# EAGLE design scarf_no_mic (EAGLE 6.5.0)
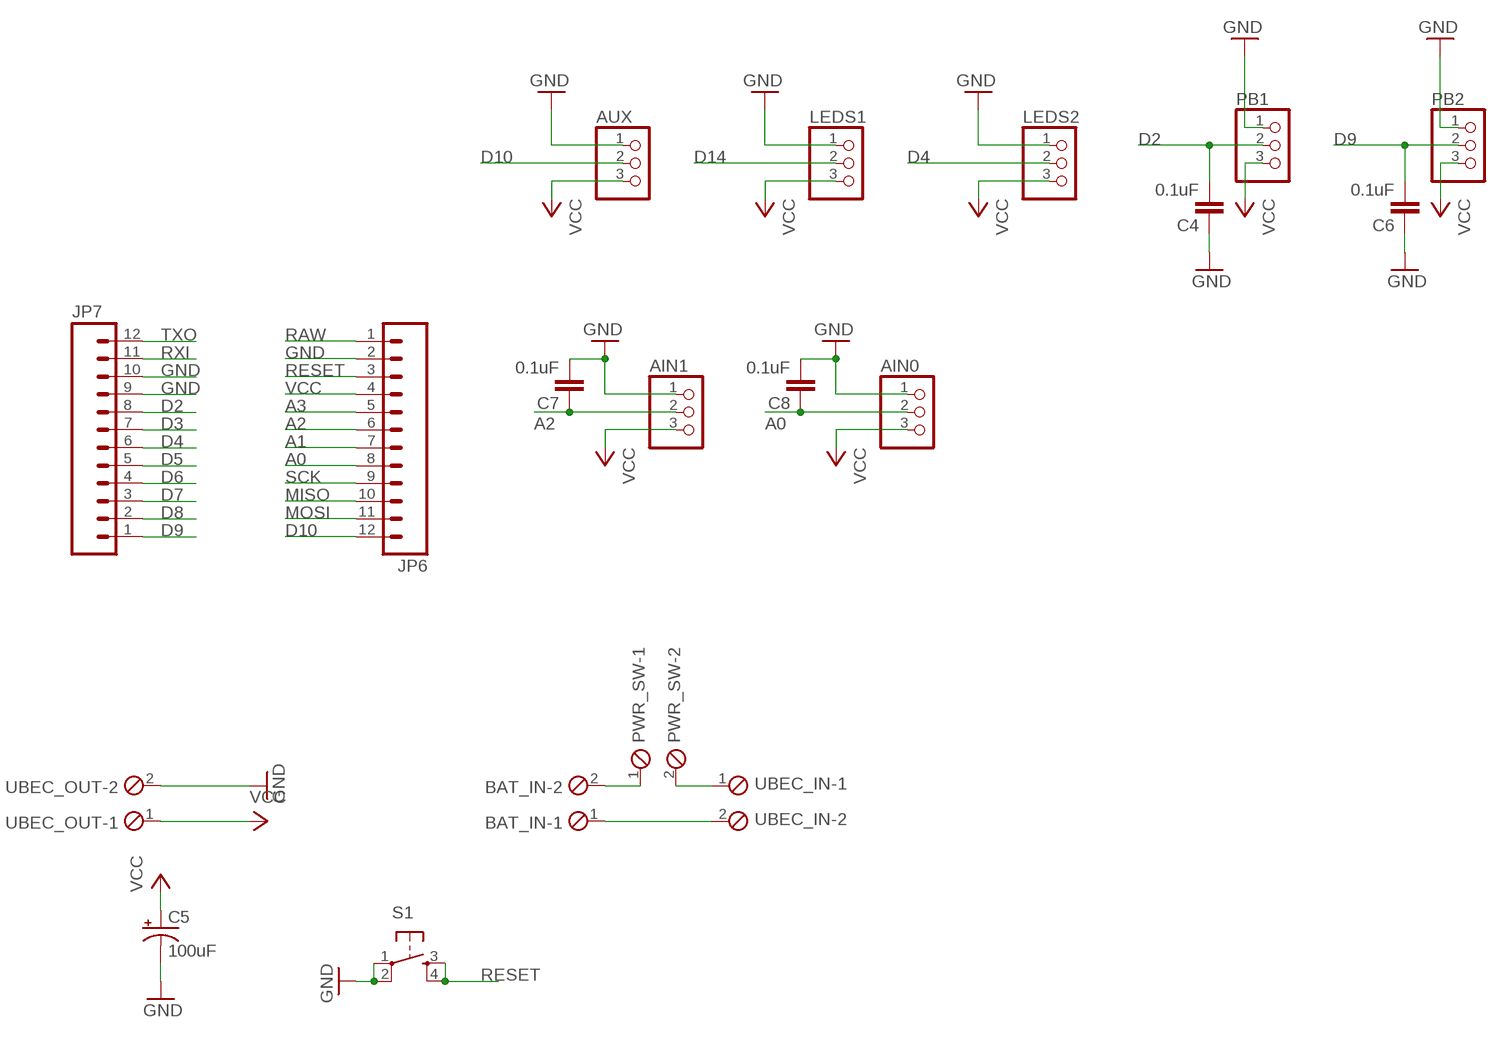
[diagram p0: schematic, sheet 1]

## Parts
AIN0  HEADER-1X3ROUND  [1X03_ROUND]
AIN1  HEADER-1X3ROUND  [1X03_ROUND]
AUX  HEADER-1X3ROUND  [1X03_ROUND]
BAT_IN  MPT2  [2POL254]
C4  0.1uF  C-EU025-025X050  [C025-025X050]
C5  100uF  CPOL-USE3.5-8  [E3,5-8]
C6  0.1uF  C-EU025-025X050  [C025-025X050]
C7  0.1uF  C-EU025-025X050  [C025-025X050]
C8  0.1uF  C-EU025-025X050  [C025-025X050]
JP6  M12PTH  [1X12]
JP7  M12PTH  [1X12]
LEDS1  PINHD-1X3  [1X03]
LEDS2  PINHD-1X3  [1X03]
PB1  HEADER-1X3ROUND  [1X03_ROUND]
PB2  HEADER-1X3ROUND  [1X03_ROUND]
PWR_SW  MPT2  [2POL254]
S1  TAC_SWITCHPTH  [TACTILE-PTH]
UBEC_IN  MPT2  [2POL254]
UBEC_OUT  MPT2  [2POL254]

## Nets
A0: AIN0.2 C8.1 JP6.8
A1: JP6.7
A2: AIN1.2 C7.1 JP6.6
A3: JP6.5
D2: C4.2 JP7.8 PB1.2
D3: JP7.7
D4: JP7.6 LEDS2.2
D5: JP7.5
D6: JP7.4
D7: JP7.3
D8: JP7.2
D9: C6.2 JP7.1 PB2.2
D10: AUX.2 JP6.12
D14: LEDS1.2
GND [vcc]: AIN0.1 AIN1.1 AUX.1 C4.1 C5.- C6.1 C7.2 C8.2 JP6.2 JP7.9 JP7.10 LEDS1.1 LEDS2.1 PB1.1 PB2.1 S1.1 S1.2 UBEC_OUT.2
MISO: JP6.10
MOSI: JP6.11
N$1: BAT_IN.2 PWR_SW.1
N$2: PWR_SW.2 UBEC_IN.1
N$3: BAT_IN.1 UBEC_IN.2
RAW [vcc]: JP6.1
RESET: JP6.3 S1.3 S1.4
RXI: JP7.11
SCK: JP6.9
TXO: JP7.12
VCC: AIN0.3 AIN1.3 AUX.3 C5.+ JP6.4 LEDS1.3 LEDS2.3 PB1.3 PB2.3 UBEC_OUT.1

## Library data of the parts
AIN0 AIN1 AUX PB1 PB2 = microbuilder:HEADER-1X3: PIN HEADER
BAT_IN PWR_SW UBEC_IN UBEC_OUT = con-phoenix-254:MPT2: PHOENIX CONNECTOR; OC_FARNELL: unknown; OC_NEWARK: unknown
C4 C6-C8 = rcl:C-EU: CAPACITOR, European symbol
C5 = rcl:CPOL-US: POLARIZED CAPACITOR, American symbol
JP6 JP7 = SparkFun:M12: Header 12 Standard 12-pin 0.1" header. Use with straight break away headers (SKU : PRT-00116), right angle break away headers (PRT-00553), swiss pins (PRT-00743), machine pins (PRT-00117), and female headers (PRT-00115).
LEDS1 LEDS2 = pinhead:PINHD-1X3: PIN HEADER
S1 = SparkFun-Electromechanical:TAC_SWITCH: Momentary Switch Button commonly used for reset or general input. Spark Fun Electronics SKU : COM-00097 SMT- SWCH-08247

## Net classes
0 default: width 0.254 mm
1 vcc: width 0.406 mm

## Board
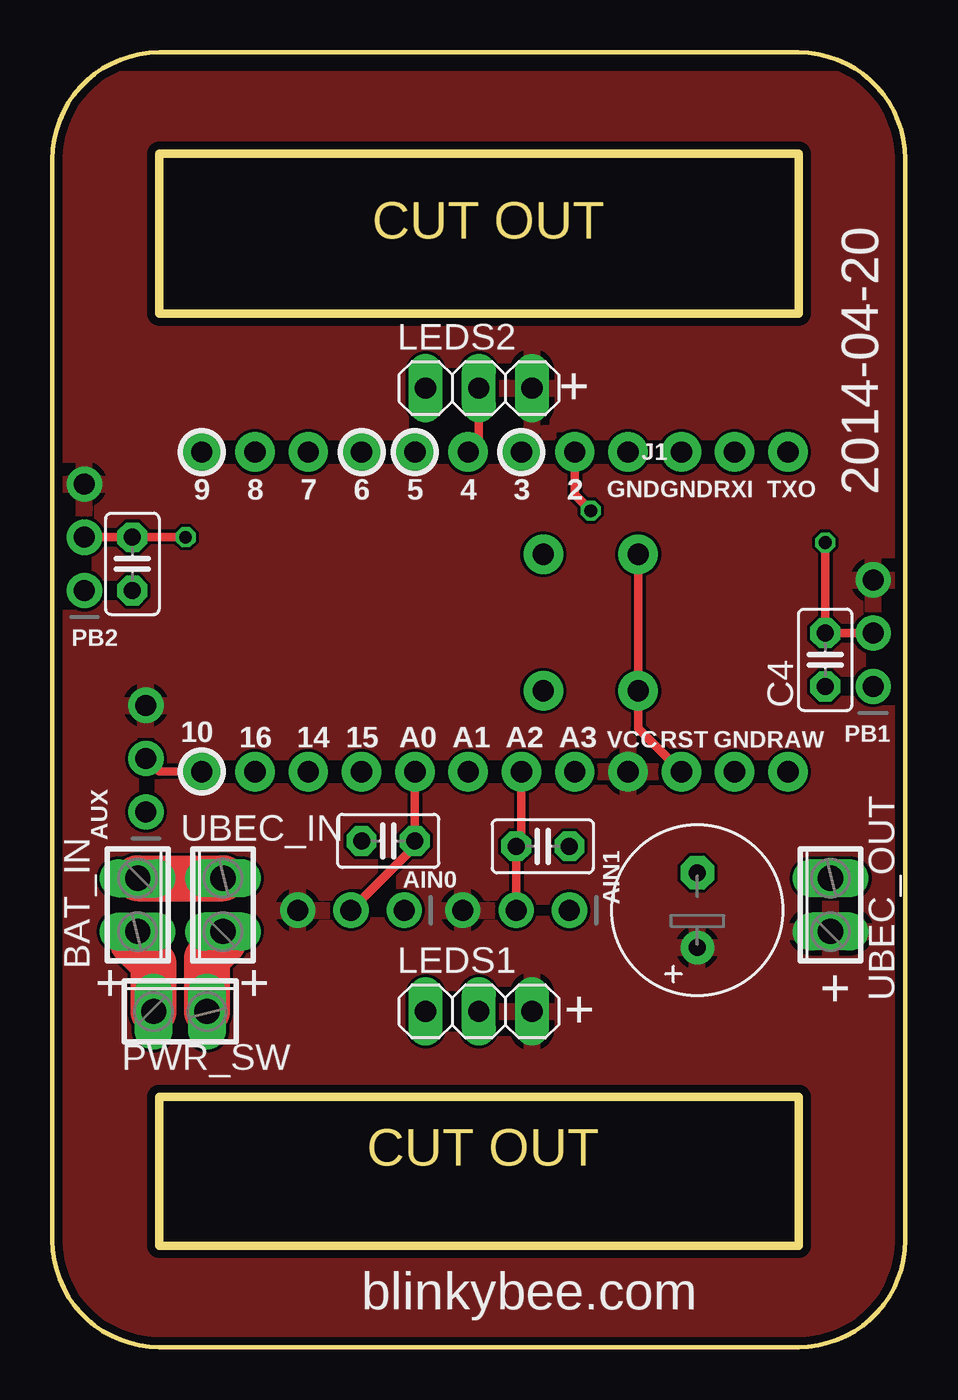
[diagram p1: board, top side]
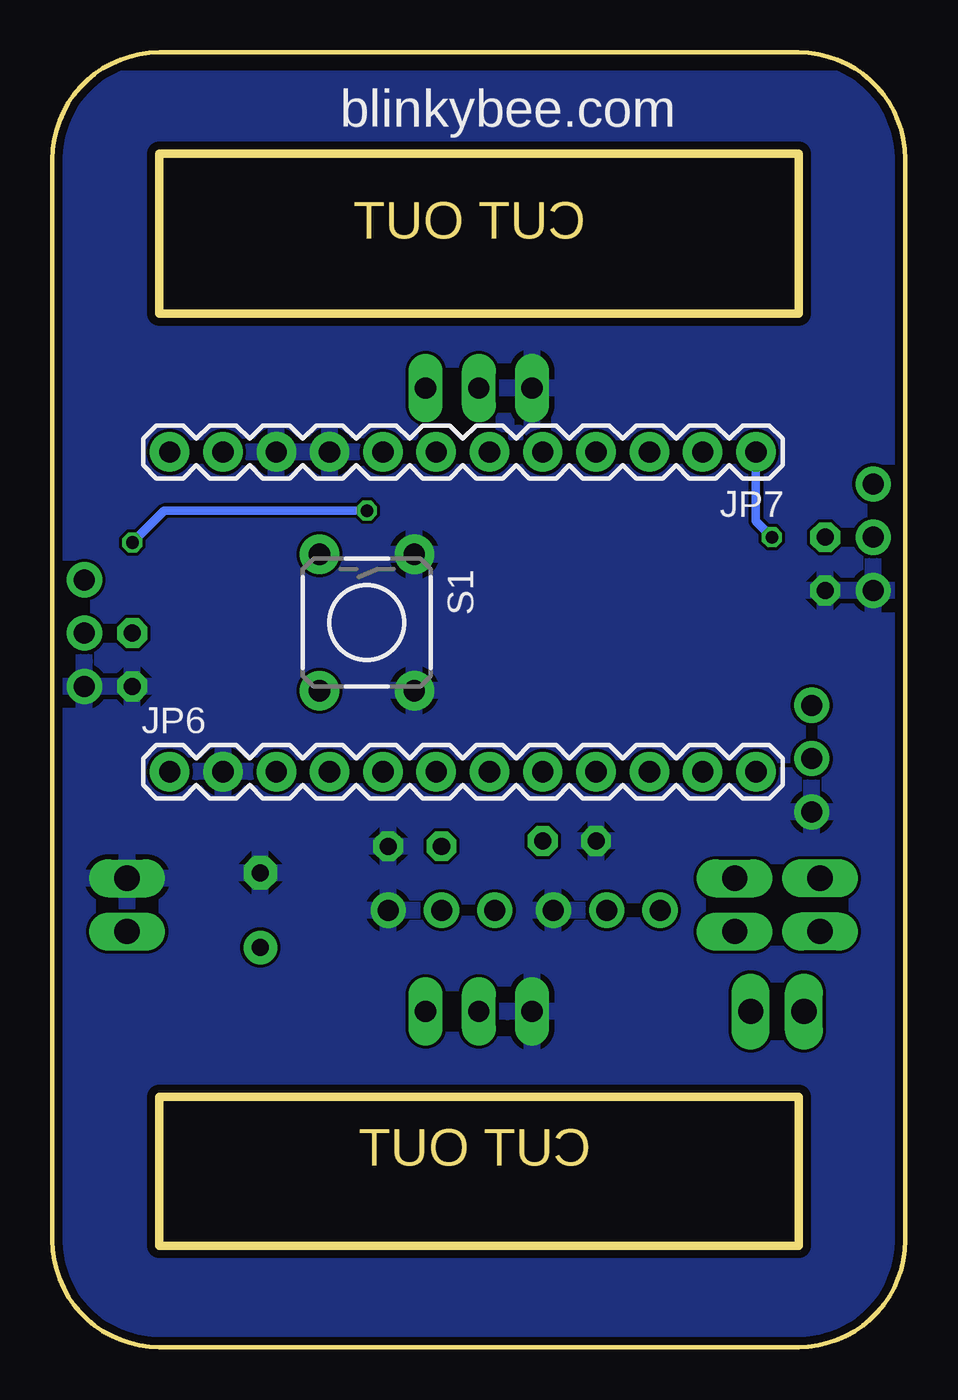
[diagram p2: board, bottom side, seen from below]

Size 40.64 x 61.72 mm. Coordinates in mm from the lower left corner, seen from the top.
Outline: 40.64,56.64 40.64,5.08 arc-90 35.56,0 5.08,0 arc-90 0,5.08 0,56.64 arc-90 5.08,61.72 35.56,61.72 arc-90 40.64,56.64
Outline: 5.08,56.9 35.56,56.9 35.56,49.28 5.08,49.28 5.08,56.9
Outline: 5.08,11.94 35.56,11.94 35.56,4.83 5.08,4.83 5.08,11.94
Copper layers (1*16): Top 0.0356mm / dielectric 1.5011mm / Bottom 0.0356mm
Design rules "oshpark_2layer *": minimum track width 6mil, minimum drill 13mil, track to track 6mil, track to pad 6mil, pad to pad 6mil, via to via 6mil, smd to smd 6mil, copper to edge 15mil, drill to drill 6mil, minimum pad ring 12mil, minimum via ring 7mil, stop-mask expansion 3mil, vias tented up to drill 20mil, thermal gap 10mil

### Footprints (pad centres in the part's own frame; a part is rotated, then mirrored left to right if it is on the bottom)
1X03_ROUND = drill 1 pad 1.676: 1 -2.54,0; 2 0,0; 3 2.54,0
2POL254 = drill 1.2 long: 1 -1.27,0; 2 1.27,0
C025-025X050 = drill 0.813 octagon: 1 -1.27,0; 2 1.27,0
E3,5-8 = drill 0.813 pad 1.6: + -1.778,0 | drill 0.813 pad 1.6 octagon: - 1.778,0
1X12 = drill 1.016 pad 1.88: 1 0,0; 2 2.54,0; 3 5.08,0; 4 7.62,0; 5 10.16,0; 6 12.7,0; 7 15.24,0; 8 17.78,0; 9 20.32,0; 10 22.86,0; 11 25.4,0; 12 27.94,0
1X03 = drill 1.016 long: 1 -2.54,0; 2 0,0; 3 2.54,0
TACTILE-PTH = drill 1.016 pad 1.88: 1 -3.251,2.261; 2 3.251,2.261; 3 -3.251,-2.261; 4 3.251,-2.261

### Placement (x,y rotation side)
AIN0  14.22,20.83 180 top
AIN1  22.1,20.83 180 top
AUX  4.45,28.06 90 top
BAT_IN  4.06,21.08 270 top
C4  36.83,32.77 90 top
C5  30.73,20.83 90 top
C6  3.81,37.34 90 top
C7  23.37,23.88 0 top
C8  16,24.13 180 top
JP6  35.05,27.43 0 bottom
JP7  7.11,42.67 180 bottom
LEDS1  20.32,16 0 top
LEDS2  20.32,45.72 0 top
PB1  39.12,34.04 90 top
PB2  1.52,38.61 90 top
PWR_SW  6.1,16 0 top
S1  25.65,34.54 270 bottom
UBEC_IN  8.13,21.08 90 top
UBEC_OUT  37.08,21.08 90 top

### Tracks (layer width: path | path; a pad name or v marks a point on that pad's centre or on a via)
A0
  Top 0.406: JP6.8 C8.1 | 17.27,23.62 C8.1 | C8.1 17.27,23.88 AIN0.2
A2
  Top 0.406: JP6.6 22.35,24.13 C7.1 AIN1.2
D2  (via drill 0.6)
  Top 0.406: JP7.8 24.89,40.64 v25.65,39.88 | v36.83,38.35 C4.2 PB1.2
  Bottom 0.406: v25.65,39.88 35.31,39.88 v36.83,38.35
D4
  Top 0.406: LEDS2.2 20.32,43.18 JP7.6
D9  (via drill 0.6)
  Top 0.406: PB2.2 C6.2 v6.35,38.61
  Bottom 0.406: JP7.1 7.11,39.37 v6.35,38.61
D10
  Top 0.406: JP6.12 5.08,27.43 AUX.2
GND
  pour Bottom: 40.39,60.45 40.39,0.25 0.25,0.25 0.25,60.45
N$1
  Top 1.422: 3.81,19.3 3.81,19.56 BAT_IN.2
  Top 2.184: PWR_SW.1 4.83,18.29 3.81,19.3
N$2
  Top 1.422: 8.13,19.3 UBEC_IN.1
  Top 2.184: PWR_SW.2 7.37,18.54 8.13,19.3
N$3
  Top 2.184: BAT_IN.1 UBEC_IN.2
RESET
  Top 0.406: S1.3 S1.4 27.91,29.49 JP6.3
VCC
  pour Top: 40.39,60.45 40.39,0.25 0.25,0.25 0.25,60.45

### Text on the board
Dimension: CUT OUT | CUT OUT
tPlace: J1 | GND | GND | RXI | TXO | 9 | 8 | 7 | 6 | 5 | 4 | 3 | 2 | 14 | 10 | 16 | 15 | A0 | A1 | A2 | A3 | VCC | RST | GND | RAW
tNames: + | 2014-04-20 | + | + | + | + | blinkybee.com
bNames: blinkybee.com